# EAGLE design growth_v2 (EAGLE 9.5.0)
REV: p2; TITLE: Elemental Growth
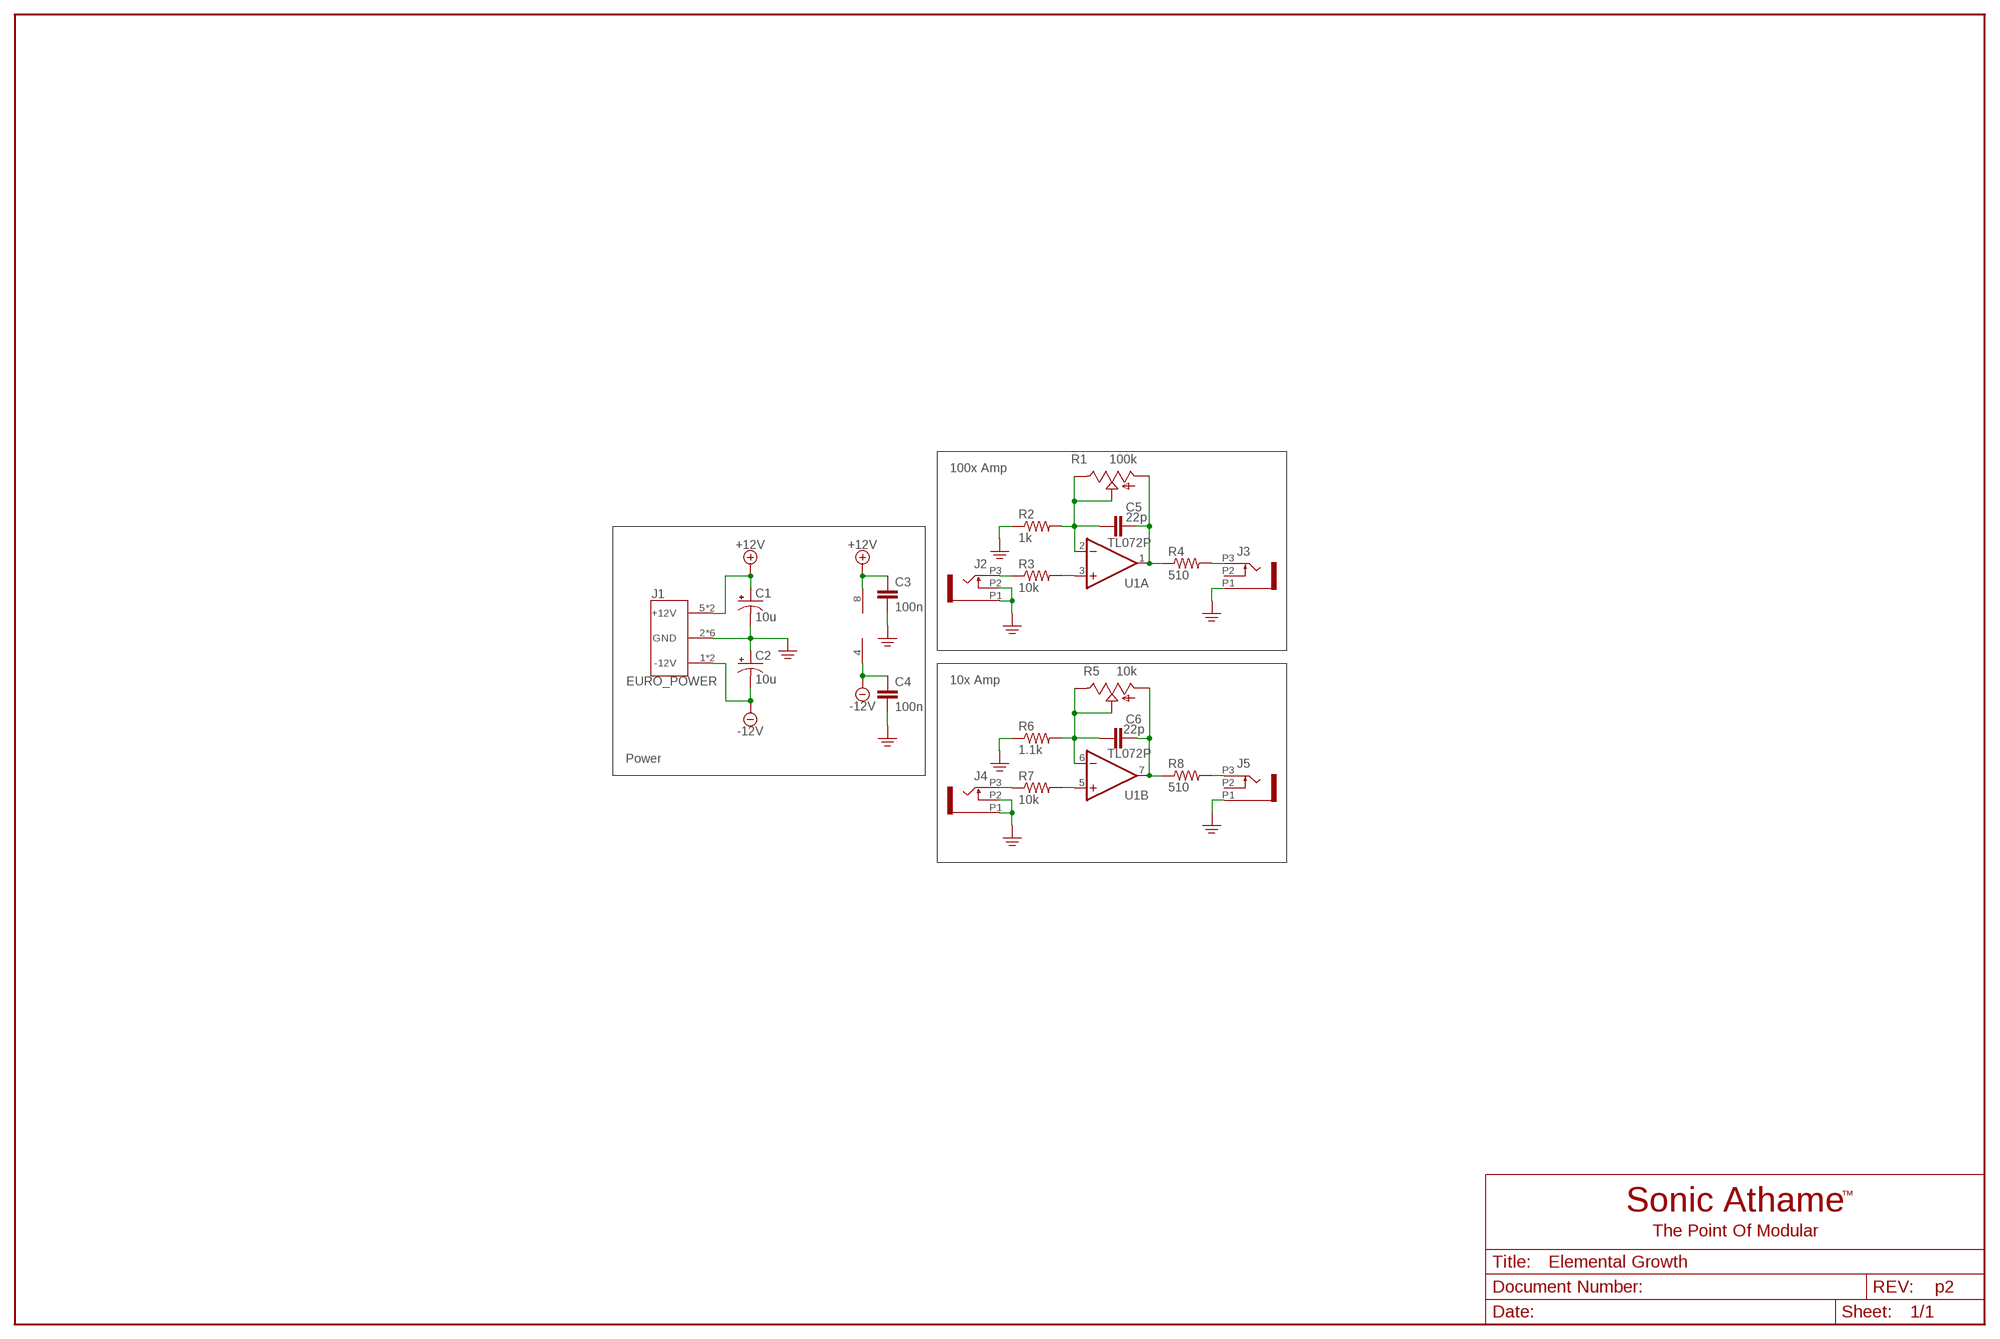
[diagram p0: schematic, sheet 1]

## Parts
C1  10u  CAP_POLLYTIC_H_L  [TT2D5L_FLIP]
C2  10u  CAP_POLLYTIC_H_L  [TT2D5L_FLIP]
C3  100n  CAP_NONPOL025-024X044  [C025-024X044]
C4  100n  CAP_NONPOL025-024X044  [C025-024X044]
C5  22p  CAP_NONPOL050-024X044  [C050-024X044]
C6  22p  CAP_NONPOL050-024X044  [C050-024X044]
J1  EURO_POWER  [EURO_POWER]
J2  WQP-PJ398SM6  [WQP_PJ_301M6]
J3  WQP-PJ398SM6  [WQP_PJ_301M6]
J4  WQP-PJ398SM6  [WQP_PJ_301M6]
J5  WQP-PJ398SM6  [WQP_PJ_301M6]
R1  100k  ALPHA_POT_VERTICALVERTICAL  [ALPHA_POT_VERTICAL]
R2  1k  RESISTOR0207/2V  [0207/2V]
R3  10k  RESISTOR0207/2V  [0207/2V]
R4  510  RESISTOR0207/2V  [0207/2V]
R5  10k  ALPHA_POT_VERTICALVERTICAL  [ALPHA_POT_VERTICAL]
R6  1.1k  RESISTOR0207/2V  [0207/2V]
R7  10k  RESISTOR0207/2V  [0207/2V]
R8  510  RESISTOR0207/2V  [0207/2V]
U1  TL072P  [DIL08]

## Nets
+12V: C1.+ C3.1 J1.5(+12V) J1.6(+12V) U1.8(P:V+)
-12V: C2.- C4.1 J1.1(-12V) J1.10(-12V) U1.4(P:V-)
GND: C1.- C2.+ C3.2 C4.2 J1.2(GND) J1.3(GND) J1.4(GND) J1.7(GND) J1.8(GND) J1.9(GND) J2.P1 J2.P2 J3.P1 J4.P1 J4.P2 J5.P1 R2.1 R6.1
N$1: C5.1 R1.P$1(E) R1.P$2(S) R2.2 U1.2(A:-IN)
N$2: C5.2 R1.P$3(A) R4.1 U1.1(A:OUT)
N$3: R3.2 U1.3(A:+IN)
N$4: J2.P3 R3.1
N$5: J5.P3 R8.2
N$6: J3.P3 R4.2
N$7: R7.2 U1.5(B:+IN)
N$9: C6.1 R5.P$1(E) R5.P$2(S) R6.2 U1.6(B:-IN)
N$10: C6.2 R5.P$3(A) R8.1 U1.7(B:OUT)
N$11: J4.P3 R7.1
Unconnected: J3.P2 J5.P2

## Notes on the sheet
- 100x Amp
- 10x Amp
- Power

## Library data of the parts
C1 C2 = SonicAthame:CAP_POL: POLARIZED CAPACITOR, American symbol
C3-C6 = SonicAthame:CAP_NONPOL: CAPACITOR, European symbol; SPICEPREFIX: C
J1 = SonicAthame:EURO_POWER
J2-J5 = SonicAthame:WQP-PJ398SM
R1 R5 = SonicAthame:ALPHA_POT_VERTICAL
R2-R4 R6-R8 = SonicAthame:RESISTOR: RESISTOR, American symbol; SPICEPREFIX: R
U1 = SonicAthame:TL072: OP AMP

## Board
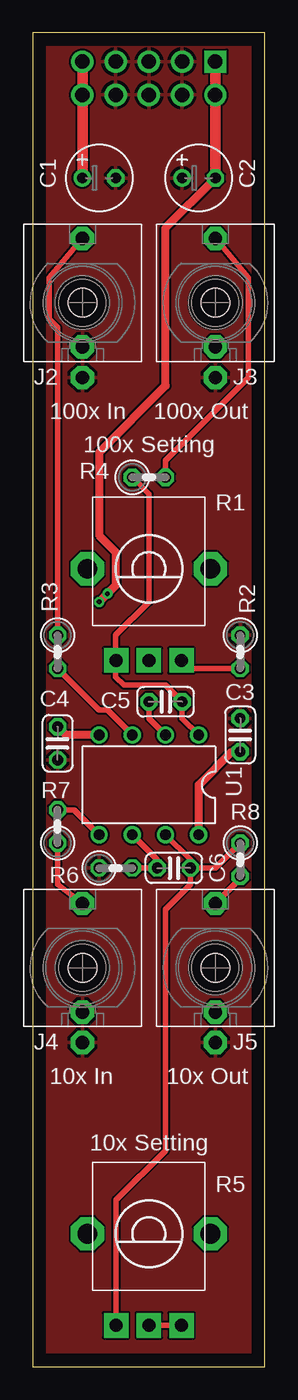
[diagram p1: board, top side]
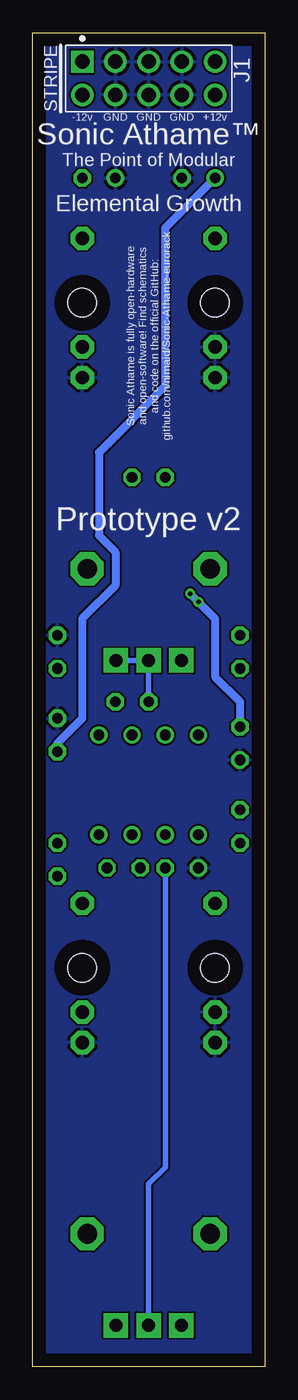
[diagram p2: board, bottom side, seen from below]

Size 17.76 x 101.91 mm. Coordinates in mm from the lower left corner, seen from the top.
Outline: 0,0 17.76,0 17.76,101.91 0,101.91 0,0
Copper layers (1*16): Top 0.035mm / dielectric 1.5mm / Bottom 0.035mm
Design rules "default": minimum track width 6mil, minimum drill 0.35mm, track to track 6mil, track to pad 6mil, pad to pad 6mil, via to via 6mil, smd to smd 6mil, copper to edge 40mil, drill to drill 6mil, minimum pad ring 10mil, minimum via ring 8mil, stop-mask expansion 4mil, vias tented up to drill 0mil, thermal gap 10mil

### Footprints (pad centres in the part's own frame; a part is rotated, then mirrored left to right if it is on the bottom)
TT2D5 = drill 0.813: + -1.27,0 | drill 0.813 octagon: - 1.27,0
C025-024X044 = drill 0.813 octagon: 1 -1.27,0; 2 1.27,0
EURO_POWER = drill 1.105 pad 1.705 square: 1 -5.08,1.27 | drill 1.105 pad 1.705: 2 -2.54,1.27; 3 0,1.27; 4 2.54,1.27; 5 5.08,1.27; 6 5.08,-1.27; 7 2.54,-1.27; 8 0,-1.27; 9 -2.54,-1.27; 10 -5.08,-1.27
WQP_PJ_301M6 = drill 1.016 pad 1.778 octagon: P1 0,-5.715; P2 0,-3.38; P3 0,4.92 | hole 2.2: 0,0
ALPHA_POT_VERTICAL = drill 1 pad 1.88 square: P$1 -2.5,7; P$2 0,7; P$3 2.5,7 | drill 1.5 pad 2.54 octagon: P$4 -4.7,0; P$5 4.7,0
0207/2V = drill 0.813 octagon: 1 -1.27,0; 2 1.27,0
DIL08 = drill 0.813 pad 1.27: 1 -3.81,-3.81; 2 -1.27,-3.81; 3 1.27,-3.81; 4 3.81,-3.81; 5 3.81,3.81; 6 1.27,3.81; 7 -1.27,3.81; 8 -3.81,3.81

### Placement (x,y rotation side)
C1  10u  [TT2D5]  5.08,90.81 0 top
C2  10u  [TT2D5]  12.7,90.81 0 top
C3  15.88,48.26 90 top
C4  1.91,47.62 270 top
C5  22p  [C025-024X044]  10.16,50.8 0 top
C6  22p  [C025-024X044]  10.79,38.1 0 top
J1  8.89,98.42 0 bottom
J2  3.81,81.28 0 top
J3  13.97,81.28 0 top
J4  3.81,30.48 0 top
J5  13.97,30.48 0 top
R1  8.89,60.96 180 top
R2  15.88,54.61 270 top
R3  1.91,54.61 270 top
R4  8.89,67.94 0 top
R5  8.89,10.16 180 top
R6  6.35,38.1 0 top
R7  1.91,41.27 90 top
R8  15.88,38.73 270 top
U1  8.89,44.45 180 top

### Tracks (layer width: path | path; a pad name or v marks a point on that pad's centre or on a via)
+12V
  Top 0.61: U1.8 12.7,44.45 15.24,46.99 C3.1
  Top 0.813: J1.5 J1.6 C1.+
  Bottom 0.61: C1.+ 7.62,87 7.62,74.93 12.7,69.85 12.7,63.5 11.43,62.23 11.43,59.69 13.97,57.15 13.97,49.53 15.88,47.62 C3.1
-12V  (via drill 0.35)
  Top 0.61: U1.4 2.54,48.26 C4.1 | v5.08,58.42 v5.71,59.05 6.35,59.69 6.35,62.23 5.08,63.5 5.08,69.85 10.16,74.93 10.16,87 C2.-
  Top 0.813: J1.1 J1.10 C2.-
  Bottom 0.61: C4.1 1.91,50.8 3.81,52.7 3.81,57.15 v5.08,58.42 v5.71,59.05
GND
  pour Bottom: 0,0 17.78,0 17.78,102.23 0,102.23
  pour Top: 0,0 17.78,0 17.78,102.23 0,102.23
N$1
  Top 0.406: R2.2 12.01,53.34 R1.P$1 | U1.2 8.89,49.53 C5.1
  Bottom 0.406: R1.P$1 R1.P$2 C5.1
N$2
  Top 0.406: R4.1 8.89,66.67 8.89,58.42 6.35,55.88 6.35,54 | 6.35,54 R1.P$3 | U1.1 11.43,49.53 C5.2 10.16,52.07 6.99,52.07 6.35,52.7 6.35,54
N$3
  Top 0.406: U1.3 5.71,50.16 5.08,50.16 R3.2
N$4
  Top 0.406: R3.1 1.91,79.38 1.27,80.01 1.27,83.19 J2.P3
N$5
  Top 0.406: R8.2 15.88,37.3 J5.P3
N$6
  Top 0.406: J3.P3 16.51,83.19 16.51,75.56 10.16,69.22 R4.2
N$7
  Top 0.406: U1.5 3.17,42.55 R7.2
N$9
  Top 0.406: R5.P$2 R5.P$1 | U1.6 9.53,38.73 C6.1 R6.2
  Bottom 0.406: R6.2 7.62,15.24 8.89,13.97 R5.P$2
N$10
  Top 0.406: C6.2 12.06,38.73 U1.7 | R8.1 13.97,38.1 C6.2 | R5.P$3 6.39,12.74 10.16,16.51 10.16,34.92 12.06,36.83 C6.2
N$11
  Top 0.406: J4.P3 1.91,36.83 R7.1

### Text on the board
tNames: 100x In | 100x Out | 100x Setting | 10x In | 10x Out | 10x Setting
bNames: Sonic Athame™ | The Point of Modular | Elemental Growth | Sonic Athame is fully open-hardware / and open-software! Find schematics / and code on the official GitHub: / github.com/nimaid/Sonic-Athame-eurorack | Prototype v2